# Altium project Power-LED.PrjPCB
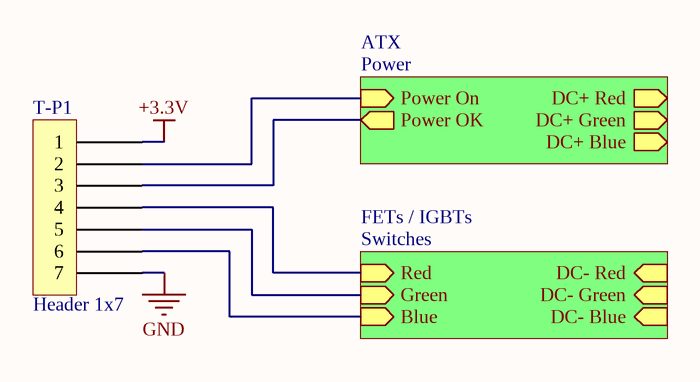
[diagram p0: Top.SchDoc]
4 sheets, 19 parts. Net scope: hierarchical (ports join the sheet entries above them; power ports are global).
Board file: Board.PcbDoc
Sheets:
  Top.SchDoc
    ATX = Power.SchDoc
      uC Power Supply = LDO-3V3.SchDoc
    FETs / IGBTs = Switches.SchDoc

## Sheet Top.SchDoc
size A4

### Parts
T-P1  Header 1x7  [Header 1x7]

### Sub-sheets
ATX = Power: Power On (in), Power OK (out), DC+ Red (out), DC+ Green (out), DC+ Blue (out)
FETs / IGBTs = Switches: Red (in), Green (in), Blue (in), DC- Red (in), DC- Green (in), DC- Blue (in)

### Nets
+3.3V: T-P1.1
GND: T-P1.7
NetP-R3_1: T-P1.3 ; sheet ATX/Power OK
NetP-T1_1: T-P1.2 ; sheet ATX/Power On
NetS-T1_G: T-P1.4 ; sheet FETs / IGBTs/Red
NetS-T2_G: T-P1.5 ; sheet FETs / IGBTs/Green
NetS-T3_G: T-P1.6 ; sheet FETs / IGBTs/Blue

## Sheet Power.SchDoc
size A4
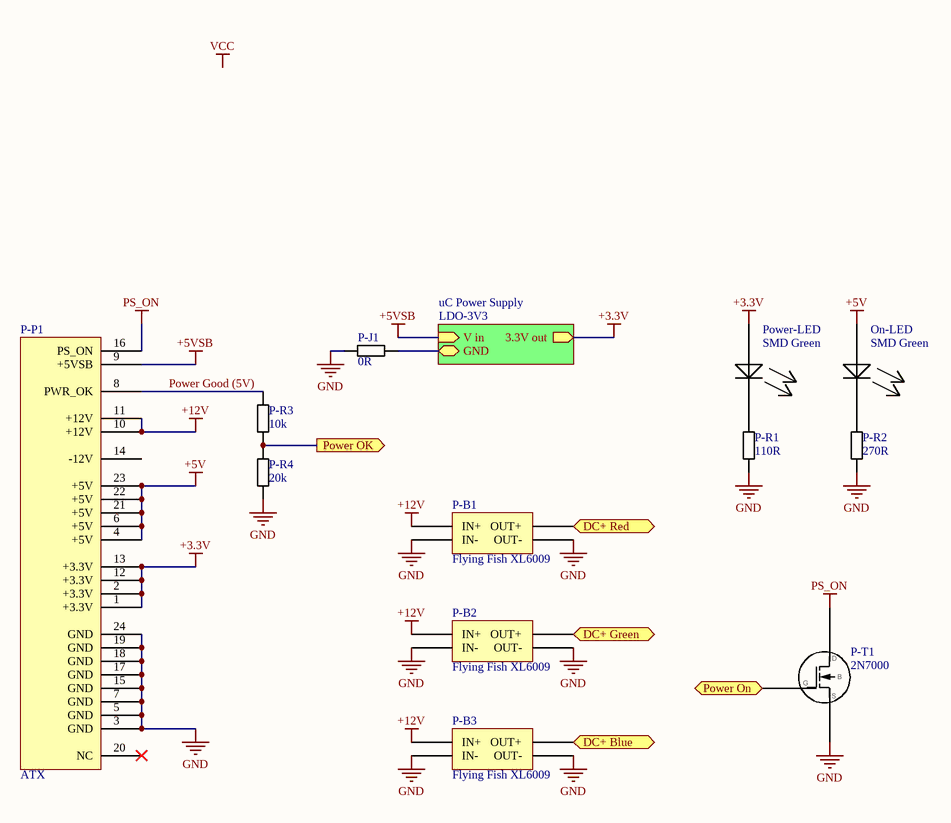
[diagram p1: Power.SchDoc]

### Parts
On-LED  SMD Green  [LED 0603]
P-B1  Flying Fish XL6009  [Flying Fish XL6009 small]
P-B2  Flying Fish XL6009  [Flying Fish XL6009 small]
P-B3  Flying Fish XL6009  [Flying Fish XL6009 small]
P-J1  0R  [R 0805 / 2012 wide]
P-P1  ATX  [ATX]
P-R1  110R  [R 0805 / 2012]
P-R2  270R  [R 0805 / 2012]
P-R3  10k  [R 0805 / 2012]
P-R4  20k  [R 0805 / 2012]
P-T1  2N7000  [SOT-23-3]
Power-LED  SMD Green  [LED 0603]

### Sub-sheets
uC Power Supply = LDO-3V3: V in (in), 3.3V out (out), GND

### Ports
DC+ Blue (out), DC+ Green (out), DC+ Red (out), Power OK (out), Power On (in)

### Nets
+3.3V: P-P1.1(+3.3V) P-P1.2(+3.3V) P-P1.12(+3.3V) P-P1.13(+3.3V) Power-LED.1(+) ; sheet uC Power Supply/3.3V out
+5V: On-LED.1(+) P-P1.4(+5V) P-P1.6(+5V) P-P1.21(+5V) P-P1.22(+5V) P-P1.23(+5V)
+5VSB: P-P1.9(+5VSB) ; sheet uC Power Supply/V in
+12V: P-B1.IN+ P-B2.IN+ P-B3.IN+ P-P1.10(+12V) P-P1.11(+12V)
GND: P-B1.IN- P-B1.OUT- P-B2.IN- P-B2.OUT- P-B3.IN- P-B3.OUT- P-J1.1 P-P1.3(GND) P-P1.5(GND) P-P1.7(GND) P-P1.15(GND) P-P1.17(GND) P-P1.18(GND) P-P1.19(GND) P-P1.24(GND) P-R1.1 P-R2.1 P-R4.1 P-T1.2
PS_ON: P-P1.16(PS_ON) P-T1.3
Power Good (5V): P-P1.8(PWR_OK) P-R3.2
NetAMS1117-3.3_1: P-J1.2 ; sheet uC Power Supply/GND
NetOn-LED_2: On-LED.2(-) P-R2.2
NetP-B1_OUT+: P-B1.OUT+ ; port DC+ Red
NetP-B2_OUT+: P-B2.OUT+ ; port DC+ Green
NetP-B3_OUT+: P-B3.OUT+ ; port DC+ Blue
NetP-R1_2: P-R1.2 Power-LED.2(-)
NetP-R3_1: P-R3.1 P-R4.2 ; port Power OK
NetP-T1_1: P-T1.1 ; port Power On

Not connected (* = marked no-connect by the designer): P-P1 14(-12V) 20(NC)*

### Notes on the sheet
- Labels drawn without touching a wire or pin: VCC

### Library data of the parts
On-LED Power-LED = LED
P-J1 P-R1-P-R4 = Resistor
P-P1 = ATX sorted
P-T1 = 2N7000: N-FET

## Sheet LDO-3V3.SchDoc
size A4
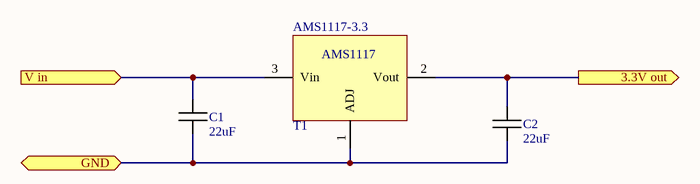
[diagram p2: LDO-3V3.SchDoc]

### Parts
AMS1117-3.3  T1  [SOT-223-3]
C1  22uF  [C 0805 / 2012]
C2  22uF  [C 0805 / 2012]

### Ports
3.3V out (out), GND, V in (in)

### Nets
+3.3V: AMS1117-3.3.2(Vout) C2.2 ; port 3.3V out
+5VSB: AMS1117-3.3.3(Vin) C1.2 ; port V in
NetAMS1117-3.3_1: AMS1117-3.3.1(ADJ) C1.1 C2.1 ; port GND

### Library data of the parts
AMS1117-3.3 = AMS1117
C1 C2 = Capacitor

## Sheet Switches.SchDoc
size A4
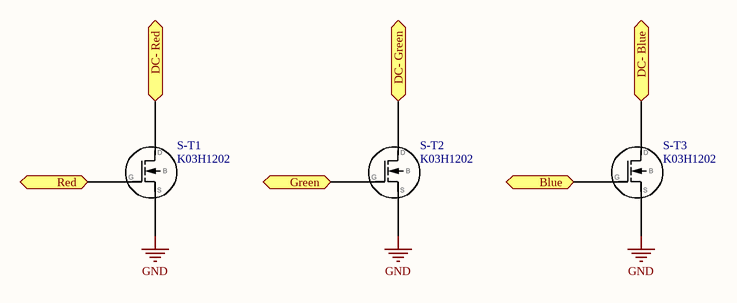
[diagram p3: Switches.SchDoc]

### Parts
S-T1  K03H1202  [TO-220-AB]
S-T2  K03H1202  [TO-220-AB]
S-T3  K03H1202  [TO-220-AB]

### Ports
Blue (in), DC- Blue (in), DC- Green (in), DC- Red (in), Green (in), Red (in)

### Nets
GND: S-T1.S S-T2.S S-T3.S
NetS-T1_D: S-T1.D ; port DC- Red
NetS-T1_G: S-T1.G ; port Red
NetS-T2_D: S-T2.D ; port DC- Green
NetS-T2_G: S-T2.G ; port Green
NetS-T3_D: S-T3.D ; port DC- Blue
NetS-T3_G: S-T3.G ; port Blue

### Library data of the parts
S-T1-S-T3 = FET N-Channel: Enhancement Type; pin to pad: D>2 G>1 S>3

## Nets that join several sheets
+3.3V: Top (T-P1.1), Power (5 pins), LDO-3V3 (AMS1117-3.3.2 C2.2)
+5VSB: Power (P-P1.9), LDO-3V3 (AMS1117-3.3.3 C1.2)
GND: Top (T-P1.7), Power (19 pins), Switches (S-T1.S S-T2.S S-T3.S)
NetAMS1117-3.3_1: Power (P-J1.2), LDO-3V3 (AMS1117-3.3.1 C1.1 C2.1)
NetP-R3_1: Top (T-P1.3), Power (P-R3.1 P-R4.2)
NetP-T1_1: Top (T-P1.2), Power (P-T1.1)
NetS-T1_G: Top (T-P1.4), Switches (S-T1.G)
NetS-T2_G: Top (T-P1.5), Switches (S-T2.G)
NetS-T3_G: Top (T-P1.6), Switches (S-T3.G)